# EAGLE design Nanocopter_V2.1 (EAGLE 7.2.0)

## Sheet 1 of 2
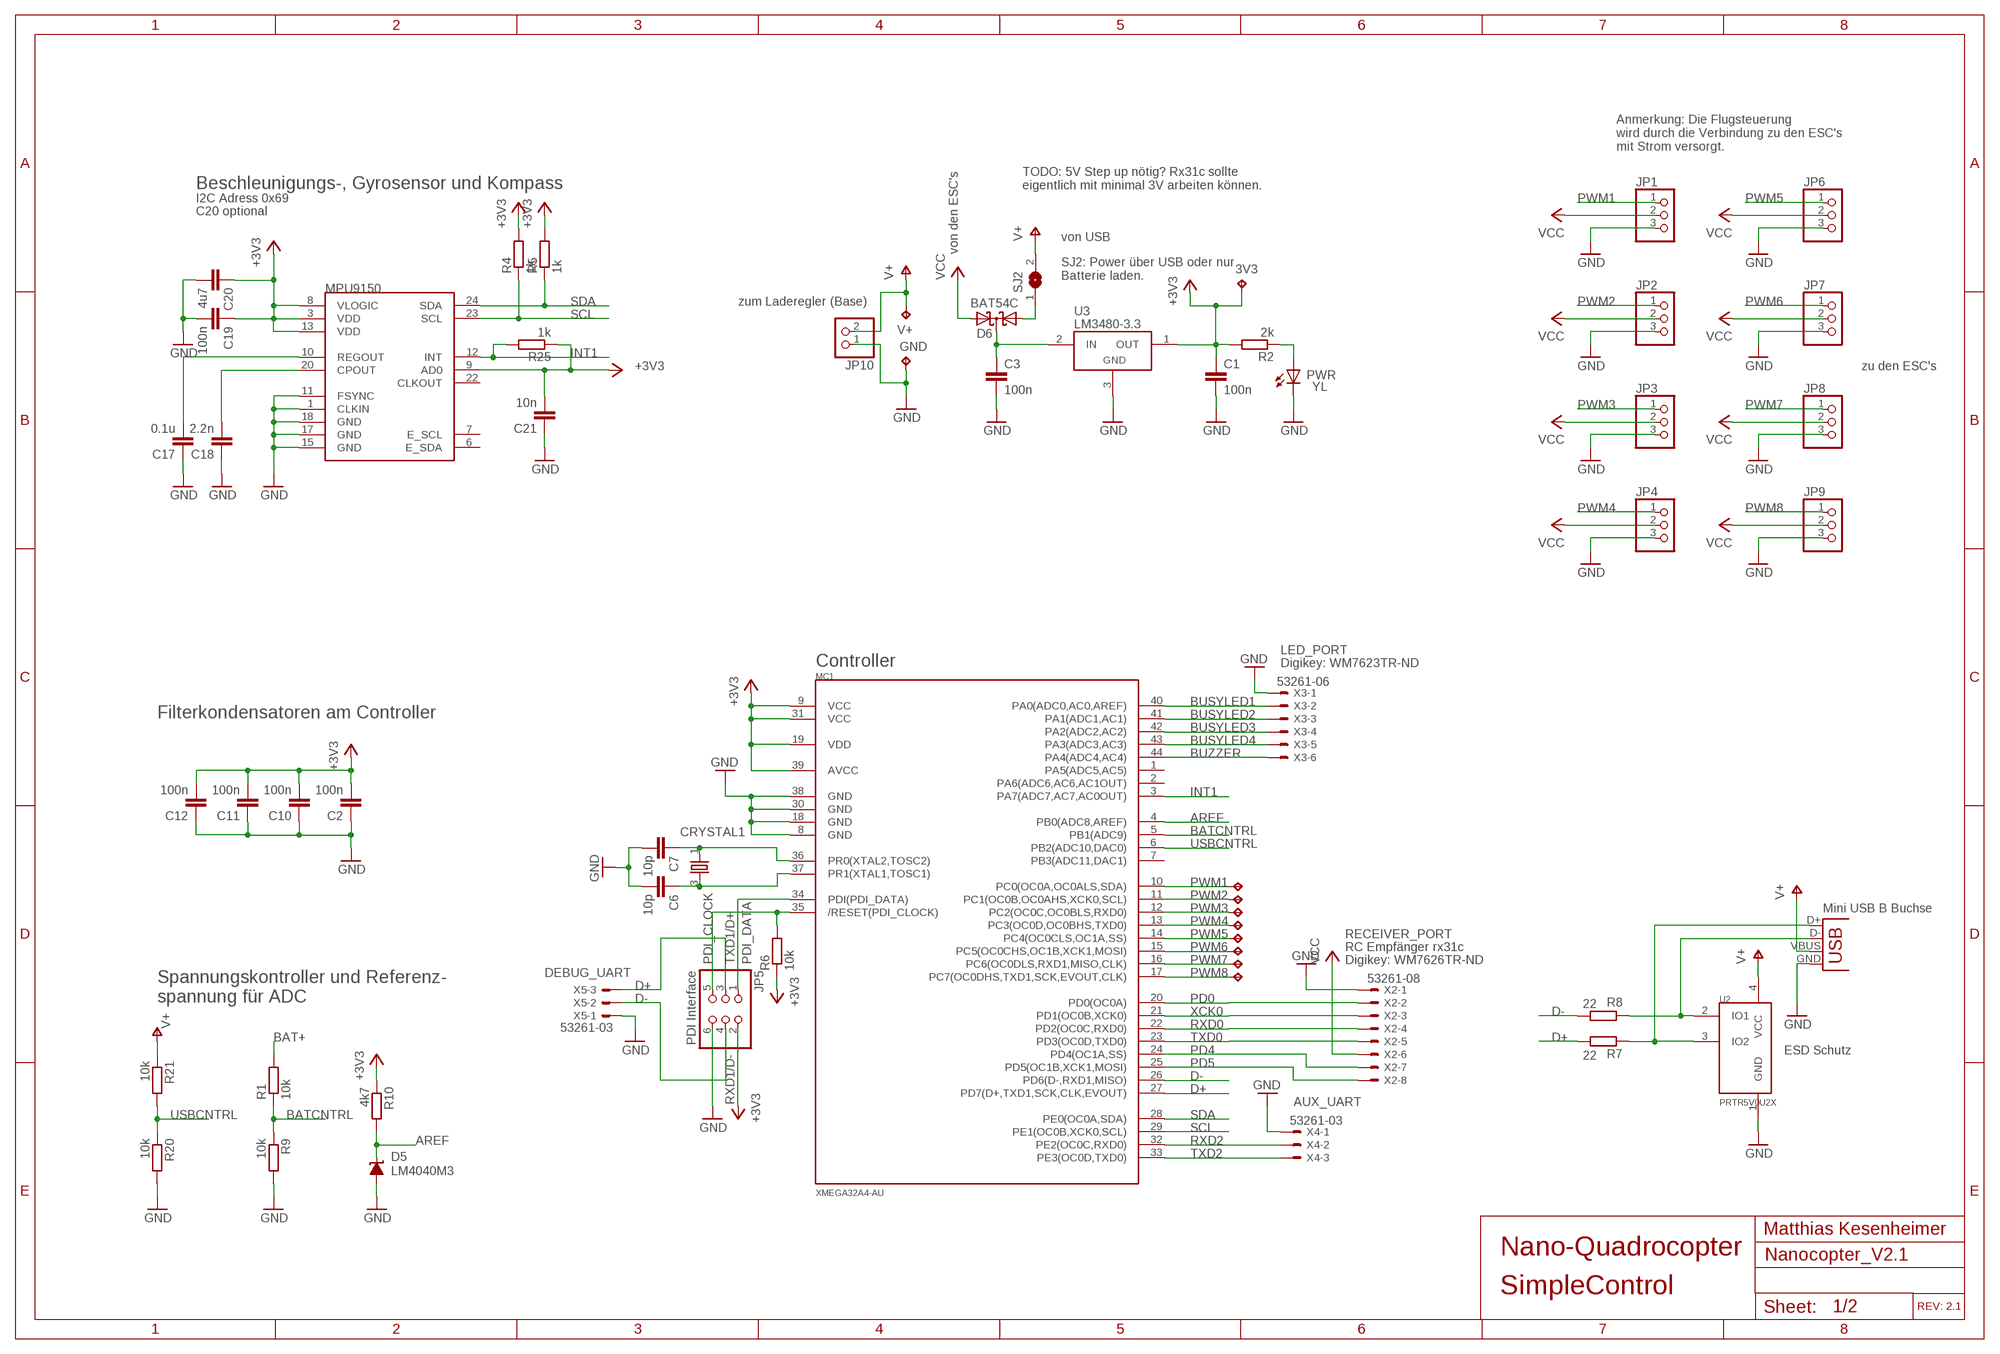
[diagram p0: schematic, sheet 1]

### Parts
3V1  TPTP12SQ  [TP12SQ]
3V2  TPTP12SQ  [TP12SQ]
3V3  TPTP12SQ  [TP12SQ]
3V4  TPTP12SQ  [TP12SQ]
3V5  TPTP12SQ  [TP12SQ]
3V6  TPTP12SQ  [TP12SQ]
3V7  TPTP12SQ  [TP12SQ]
3V8  TPTP12SQ  [TP12SQ]
C1  100n  C-EUC0603  [C0603]
C2  100n  C-EUC0603  [C0603]
C3  100n  C-EUC0603  [C0603]
C6  10p  C-EUC0603  [C0603]
C7  10p  C-EUC0603  [C0603]
C10  100n  C-EUC0603  [C0603]
C11  100n  C-EUC0603  [C0603]
C12  100n  C-EUC0603  [C0603]
C17  0.1u  C-EUC0603  [C0603]
C18  2.2n  C-EUC0603  [C0603]
C19  100n  C-EUC0603  [C0603]
C20  4u7  C-EUC0603  [C0603]
C21  10n  C-EUC0603  [C0603]
CRYSTAL1  CRYSTAL4PIN  [CRYSTAL-4PIN]
D5  LM4040M3  [SOT-23]
D6  BAT54C  [SOT23]
GND  TPTP12SQ  [TP12SQ]
JP1  PINHD-1X3  [1X03]
JP2  PINHD-1X3  [1X03]
JP3  PINHD-1X3  [1X03]
JP4  PINHD-1X3  [1X03]
JP5  PDI Interface  PINHD-2X3  [2X03]
JP6  PINHD-1X3  [1X03]
JP7  PINHD-1X3  [1X03]
JP8  PINHD-1X3  [1X03]
JP9  PINHD-1X3  [1X03]
JP10  PINHD-1X2  [1X02]
MC1  XMEGA32A4-AU  [TQFP44]
MPU9150  MPU-9150QFN-24-NP  [QFN-24-NP]
PWM1  TPTP12SQ  [TP12SQ]
PWR  YL  LEDCHIPLED_0603  [CHIPLED_0603]
R1  10k  R-EU_R0603  [R0603]
R2  2k  R-EU_R0603  [R0603]
R4  1k  R-EU_R0603  [R0603]
R5  1k  R-EU_R0603  [R0603]
R6  10k  R-EU_R0603  [R0603]
R7  22  R-EU_R0603  [R0603]
R8  22  R-EU_R0603  [R0603]
R9  10k  R-EU_R0603  [R0603]
R10  4k7  R-EU_R0603  [R0603]
R20  10k  R-EU_R0603  [R0603]
R21  10k  R-EU_R0603  [R0603]
R25  1k  R-EU_R0603  [R0603]
SJ2  SJ  [SJ]
U2  PRTR5V0U2X  [SOT143B]
U3  LM3480-3.3  [SOT-23-3]
V+  TPTP12SQ  [TP12SQ]
X1  USBSMD  [USB-MINIB]
X2  53261-08  [53261-08]
X3  53261-06  [53261-06]
X4  53261-03  [53261-03]
X5  53261-03  [53261-03]

### Nets
+3V3: 3V3.TP C1.1 C2.2 C10.2 C11.2 C12.2 C19.1 C20.1 C21.2 JP5.2 MC1.9(VCC) MC1.19(VDD) MC1.31(VCC) MC1.39(AVCC) MPU9150.3(VDD) MPU9150.8(VLOGIC) MPU9150.9(AD0) MPU9150.13(VDD) R2.2 R4.2 R5.2 R6.1 R10.1 R25.1 U3.1(OUT)
AREF: D5.1(C) MC1.4(PB0(ADC8,AREF)) R10.2
BAT+: R1.2
BATCNTRL: MC1.5(PB1(ADC9)) R1.1 R9.1
BUSYLED1: MC1.40(PA0(ADC0,AC0,AREF)) X3.2
BUSYLED2: MC1.41(PA1(ADC1,AC1)) X3.3
BUSYLED3: MC1.42(PA2(ADC2,AC2)) X3.4
BUSYLED4: MC1.43(PA3(ADC3,AC3)) X3.5
BUZZER: MC1.44(PA4(ADC4,AC4)) X3.6
D+: JP5.3 MC1.27(PD7(D+,TXD1,SCK,CLK,EVOUT)) R7.2 X5.3
D-: JP5.4 MC1.26(PD6(D-,RXD1,MISO)) R8.2 X5.2
GND: C1.2 C2.1 C3.2 C6.2 C7.2 C10.1 C11.1 C12.1 C17.1 C18.1 C19.2 C20.2 C21.1 D5.2(A) GND.TP JP1.3 JP2.3 JP3.3 JP4.3 JP5.6 JP6.3 JP7.3 JP8.3 JP9.3 JP10.1 MC1.8(GND) MC1.18(GND) MC1.30(GND) MC1.38(GND) MPU9150.1(CLKIN) MPU9150.11(FSYNC) MPU9150.15(GND) MPU9150.17(GND) MPU9150.18(GND) PWR.C R9.2 R20.2 U2.1(GND) U3.3(GND) X1.GND X2.1 X3.1 X4.1 X5.1 ; also sheet 2
INT1: MC1.3(PA7(ADC7,AC7,AC0OUT)) MPU9150.12(INT) R25.2
N$1: C18.2 MPU9150.20(CPOUT)
N$5: C17.2 MPU9150.10(REGOUT)
N$6: C3.1 D6.3(CC) U3.2(IN)
N$9: PWR.A R2.1
N$10: C7.1 CRYSTAL1.1 MC1.36(PR0(XTAL2,TOSC2))
N$15: C6.1 CRYSTAL1.3 MC1.37(PR1(XTAL1,TOSC1))
N$36: D6.1(A1) SJ2.1
PD0: MC1.20(PD0(OC0A)) X2.2
PD4: MC1.24(PD4(OC1A,SS)) X2.7
PD5: MC1.25(PD5(OC1B,XCK1,MOSI)) X2.8
PDI_CLOCK: JP5.5 MC1.35(/RESET(PDI_CLOCK)) R6.2
PDI_DATA: JP5.1 MC1.34(PDI(PDI_DATA))
PWM1: JP1.1 MC1.10(PC0(OC0A,OC0ALS,SDA)) PWM1.TP
PWM2: 3V2.TP JP2.1 MC1.11(PC1(OC0B,OC0AHS,XCK0,SCL))
PWM3: 3V4.TP JP3.1 MC1.12(PC2(OC0C,OC0BLS,RXD0))
PWM4: 3V5.TP JP4.1 MC1.13(PC3(OC0D,OC0BHS,TXD0))
PWM5: 3V1.TP JP6.1 MC1.14(PC4(OC0CLS,OC1A,SS))
PWM6: 3V6.TP JP7.1 MC1.15(PC5(OC0CHS,OC1B,XCK1,MOSI))
PWM7: 3V7.TP JP8.1 MC1.16(PC6(OC0DLS,RXD1,MISO,CLK))
PWM8: 3V8.TP JP9.1 MC1.17(PC7(OC0DHS,TXD1,SCK,EVOUT,CLK))
RXD0: MC1.22(PD2(OC0C,RXD0)) X2.4
RXD2: MC1.32(PE2(OC0C,RXD0)) X4.2
SCL: MC1.29(PE1(OC0B,XCK0,SCL)) MPU9150.23(SCL) R4.1
SDA: MC1.28(PE0(OC0A,SDA)) MPU9150.24(SDA) R5.1
TXD0: MC1.23(PD3(OC0D,TXD0)) X2.5
TXD2: MC1.33(PE3(OC0D,TXD0)) X4.3
USB+: R7.1 U2.3(IO2) X1.D+
USB-: R8.1 U2.2(IO1) X1.D-
USBCNTRL: MC1.6(PB2(ADC10,DAC0)) R20.1 R21.2
V+: JP10.2 R21.1 SJ2.2 U2.4(VCC) V+.TP X1.VBUS
VCC: D6.2(A2) JP1.2 JP2.2 JP3.2 JP4.2 JP6.2 JP7.2 JP8.2 JP9.2 X2.6 ; also sheet 2
XCK0: MC1.21(PD1(OC0B,XCK0)) X2.3
Unconnected: MC1.1(PA5(ADC5,AC5)) MC1.2(PA6(ADC6,AC6,AC1OUT)) MC1.7(PB3(ADC11,DAC1)) MPU9150.6(E_SDA) MPU9150.7(E_SCL) MPU9150.22(CLKOUT)

### Notes on the sheet
- Anmerkung: Die Flugsteuerung
  wird durch die Verbindung zu den ESC's
  mit Strom versorgt.
- Beschleunigungs-, Gyrosensor und Kompass
- TODO: 5V Step up nötig? Rx31c sollte
  eigentlich mit minimal 3V arbeiten können.
- I2C Adress 0x69
- C20 optional
- von USB
- von den ESC's
- SJ2: Power über USB oder nur
  Batterie laden.
- zum Laderegler (Base)
- zu den ESC's
- LED_PORT
- Controller | Digikey: WM7623TR-ND
- Filterkondensatoren am Controller
- TXD1/D+ | Mini USB B Buchse
- RECEIVER_PORT
- RC Empfänger rx31c
- Digikey: WM7626TR-ND
- DEBUG_UART
- Spannungskontroller und Referenz-
  spannung für ADC
- RXD1/D- | ESD Schutz
- AUX_UART
- Matthias Kesenheimer
- Nano-Quadrocopter
- SimpleControl
- REV: 2.1

## Sheet 2 of 2
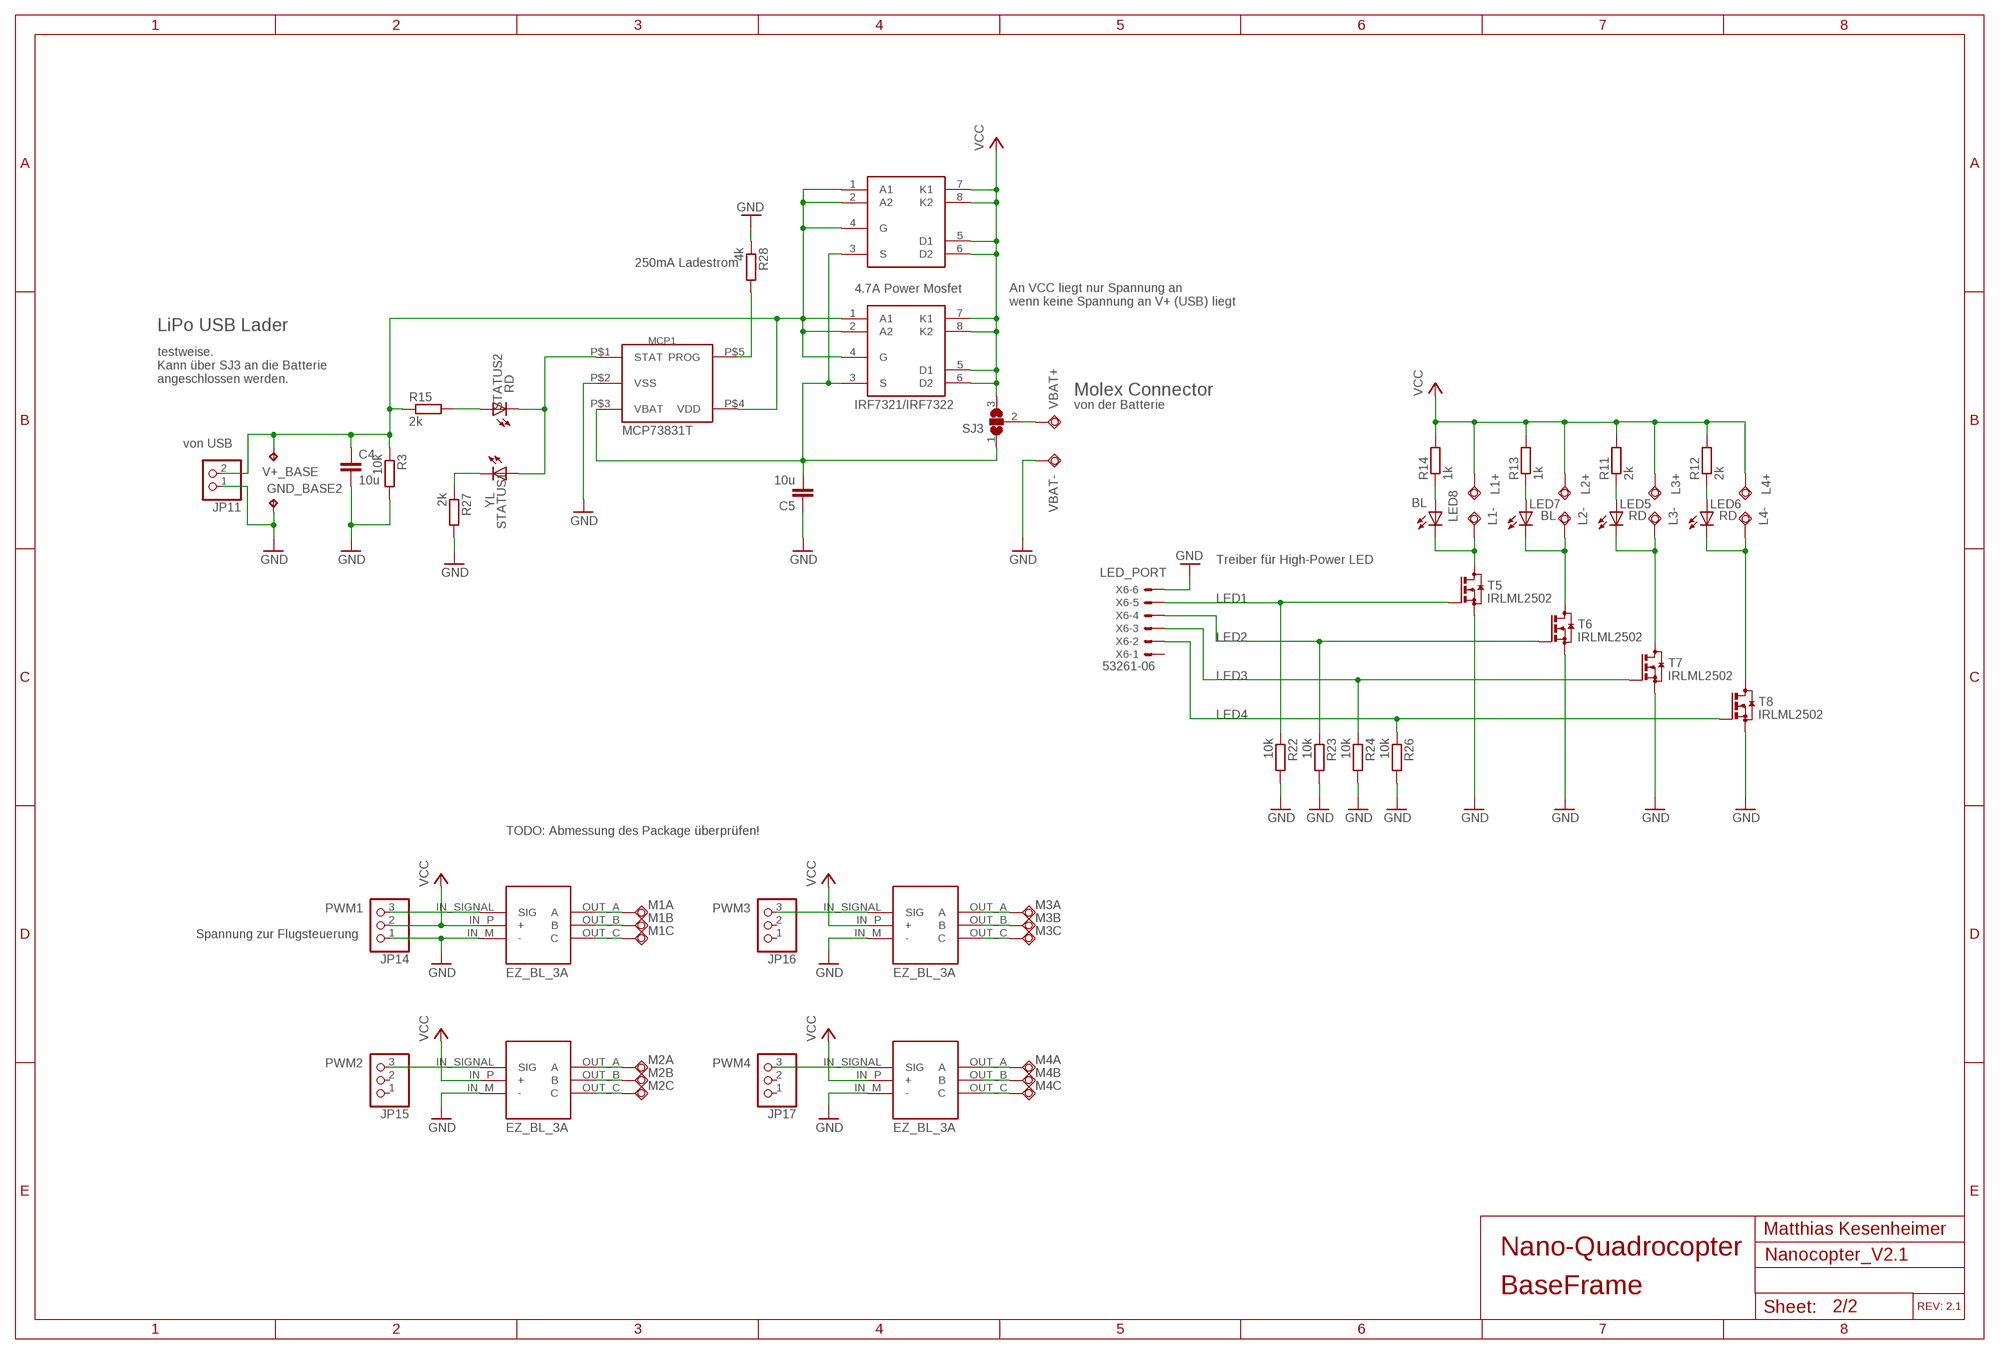
[diagram p1: schematic, sheet 2]

### Parts
C4  10u  C-EUC1206  [C1206]
C5  10u  C-EUC1206  [C1206]
GND_BASE2  TPTP12SQ  [TP12SQ]
JP11  PINHD-1X2/90  [1X02/90]
JP14  PINHD-1X3/90  [1X03/90]
JP15  PINHD-1X3/90  [1X03/90]
JP16  PINHD-1X3/90  [1X03/90]
JP17  PINHD-1X3/90  [1X03/90]
L1+  TPSQTP20SQ  [TP20SQ]
L1-  TPSQTP20SQ  [TP20SQ]
L2+  TPSQTP20SQ  [TP20SQ]
L2-  TPSQTP20SQ  [TP20SQ]
L3+  TPSQTP20SQ  [TP20SQ]
L3-  TPSQTP20SQ  [TP20SQ]
L4+  TPSQTP20SQ  [TP20SQ]
L4-  TPSQTP20SQ  [TP20SQ]
LED5  RD  LEDCHIPLED_0603  [CHIPLED_0603]
LED6  RD  LEDCHIPLED_0603  [CHIPLED_0603]
LED7  BL  LEDCHIPLED_0603  [CHIPLED_0603]
LED8  BL  LEDCHIPLED_0603  [CHIPLED_0603]
M1A  TPSQTP20SQ  [TP20SQ]
M1B  TPSQTP20SQ  [TP20SQ]
M1C  TPSQTP20SQ  [TP20SQ]
M2A  TPSQTP20SQ  [TP20SQ]
M2B  TPSQTP20SQ  [TP20SQ]
M2C  TPSQTP20SQ  [TP20SQ]
M3A  TPSQTP20SQ  [TP20SQ]
M3B  TPSQTP20SQ  [TP20SQ]
M3C  TPSQTP20SQ  [TP20SQ]
M4A  TPSQTP20SQ  [TP20SQ]
M4B  TPSQTP20SQ  [TP20SQ]
M4C  TPSQTP20SQ  [TP20SQ]
MCP1  MCP73831  [5PIN_SOT23]
R3  10k  R-EU_R0603  [R0603]
R11  2k  R-EU_R0603  [R0603]
R12  2k  R-EU_R0603  [R0603]
R13  1k  R-EU_R0603  [R0603]
R14  1k  R-EU_R0603  [R0603]
R15  2k  R-EU_R0603  [R0603]
R22  10k  R-EU_R0603  [R0603]
R23  10k  R-EU_R0603  [R0603]
R24  10k  R-EU_R0603  [R0603]
R26  10k  R-EU_R0603  [R0603]
R27  2k  R-EU_R0603  [R0603]
R28  4k  R-EU_R0603  [R0603]
SJ3  SJ2W  [SJ_2]
STATUS1  YL  LEDCHIPLED_0603  [CHIPLED_0603]
STATUS2  RD  LEDCHIPLED_0603  [CHIPLED_0603]
T5  IRLML2502  BSS123  [SOT23]
T6  IRLML2502  BSS123  [SOT23]
T7  IRLML2502  BSS123  [SOT23]
T8  IRLML2502  BSS123  [SOT23]
U$1  EAZY_BL_3A  [EZ_BL_3A_P]
U$2  EAZY_BL_3A  [EZ_BL_3A_P]
U$3  EAZY_BL_3A  [EZ_BL_3A_P]
U$4  EAZY_BL_3A  [EZ_BL_3A_P]
U$5  IRF7321  [SO8]
U$6  IRF7321  [SO8]
V+_BASE  TPTP12SQ  [TP12SQ]
VBAT+  TPSQTP20SQ  [TP20SQ]
VBAT-  TPSQTP20SQ  [TP20SQ]
X6  53261-06  [53261-06]

### Nets
GND: C4.2 C5.1 GND_BASE2.TP JP11.1 JP14.1 MCP1.P$2(VSS) R3.2 R22.2 R23.2 R24.2 R26.2 R27.2 R28.1 T5.2(S) T6.2(S) T7.2(S) T8.2(S) U$1.IN_M(-) U$2.IN_M(-) U$3.IN_M(-) U$4.IN_M(-) VBAT-.TP X6.6 ; also sheet 1
LED1: R22.1 T5.1(G) X6.5
LED2: R23.1 T6.1(G) X6.4
LED3: R24.1 T7.1(G) X6.3
LED4: R26.1 T8.1(G) X6.2
N$2: LED5.A R11.1
N$3: LED6.A R12.1
N$4: LED7.A R13.1
N$11: L1-.TP LED8.C T5.3(D)
N$12: L3-.TP LED5.C T7.3(D)
N$13: L4-.TP LED6.C T8.3(D)
N$14: L2-.TP LED7.C T6.3(D)
N$16: MCP1.P$5(PROG) R28.2
N$17: JP14.3 U$1.IN_SIGNAL(SIG)
N$18: M2A.TP U$2.OUT_A(A)
N$19: LED8.A R14.1
N$20: C5.2 MCP1.P$3(VBAT) SJ3.1 U$5.3(S) U$6.3(S)
N$21: M2B.TP U$2.OUT_B(B)
N$22: M2C.TP U$2.OUT_C(C)
N$23: R15.2 STATUS2.A
N$24: M1A.TP U$1.OUT_A(A)
N$25: M1B.TP U$1.OUT_B(B)
N$26: M1C.TP U$1.OUT_C(C)
N$27: JP15.3 U$2.IN_SIGNAL(SIG)
N$28: M3A.TP U$3.OUT_A(A)
N$29: M3B.TP U$3.OUT_B(B)
N$30: M3C.TP U$3.OUT_C(C)
N$31: JP16.3 U$3.IN_SIGNAL(SIG)
N$32: M4A.TP U$4.OUT_A(A)
N$33: M4B.TP U$4.OUT_B(B)
N$34: M4C.TP U$4.OUT_C(C)
N$35: JP17.3 U$4.IN_SIGNAL(SIG)
N$37: R27.1 STATUS1.C
N$38: MCP1.P$1(STAT) STATUS1.A STATUS2.C
N$39: SJ3.2 VBAT+.TP
VCC: JP14.2 L1+.TP L2+.TP L3+.TP L4+.TP R11.2 R12.2 R13.2 R14.2 SJ3.3 U$1.IN_P(+) U$2.IN_P(+) U$3.IN_P(+) U$4.IN_P(+) U$5.5(D1) U$5.6(D2) U$5.7(K1) U$5.8(K2) U$6.5(D1) U$6.6(D2) U$6.7(K1) U$6.8(K2) ; also sheet 1
VDD: C4.1 JP11.2 MCP1.P$4(VDD) R3.1 R15.1 U$5.1(A1) U$5.2(A2) U$5.4(G) U$6.1(A1) U$6.2(A2) U$6.4(G) V+_BASE.TP
Unconnected: JP15.1 JP15.2 JP16.1 JP16.2 JP17.1 JP17.2 X6.1

### Notes on the sheet
- 250mA Ladestrom
- 4.7A Power Mosfet
- An VCC liegt nur Spannung an
  wenn keine Spannung an V+ (USB) liegt
- LiPo USB Lader
- testweise.
  Kann über SJ3 an die Batterie
  angeschlossen werden.
- Molex Connector
- IRF7321/IRF7322 | von der Batterie
- MCP73831T
- von USB
- Treiber für High-Power LED
- LED_PORT
- TODO: Abmessung des Package überprüfen!
- PWM1 | PWM3
- Spannung zur Flugsteuerung
- EZ_BL_3A | EZ_BL_3A
- PWM2 | PWM4
- EZ_BL_3A | EZ_BL_3A
- Matthias Kesenheimer
- Nano-Quadrocopter
- BaseFrame
- REV: 2.1

## Library data of the parts
3V1-3V8 GND GND_BASE2 PWM1 V+ V+_BASE = testpad:TP: Test pad
C1-C7 C10-C12 C17-C21 = rcl:C-EU: CAPACITOR, European symbol
CRYSTAL1 = BaseApp:CRYSTAL: CRYSTAL SMD-10.5X4.8-2PIN :- http://www.digikey.com/product-detail/en/CX49GFNB12000H0PESZZ/478-4349-1-ND/1532102 SMD-5X3- 4PIN :- 535-11281-1-ND
D5 = texas:LM4040M3
D6 = diode:BAT54C: Schottky Diodes Source: Fairchild .. BAT54.pdf
JP1-JP4 JP6-JP9 JP14-JP17 = pinhead:PINHD-1X3: PIN HEADER
JP5 = pinhead:PINHD-2X3: PIN HEADER
JP10 JP11 = pinhead:PINHD-1X2: PIN HEADER
L1+ L1- L2+ L2- L3+ L3- L4+ L4- M1A M1B M1C M2A M2B M2C M3A M3B M3C M4A M4B M4C VBAT+ VBAT- = testpad:TPSQ: Test pad
LED5-LED8 PWR STATUS1 STATUS2 = led:LED: LED OSRAM: - CHIPLED LG R971, LG N971, LY N971, LG Q971, LY Q971, LO R971, LY R971 LH N974, LH R974 LS Q976, LO Q976, LY Q976 LO Q996 - Hyper CHIPLED LW Q18S LB Q993, LB Q99A, LB R99A - SideLED LS A670, LO A670, LY A670, LG A670, LP A670 LB A673, LV A673, LT A673, LW A673 LH A674 LY A675 LS A676, LA A676, LO A676, LY A676, LW A676 LS A679, LY A679, LG A679 - Hyper Micro SIDELED® LS Y876, LA Y876, LO Y876, LY Y876 LT Y87S - SmartLED LW L88C, LW L88S LB L89C, LB L89S, LG L890 LS L89K, LO L89K, LY L89K LS L896, LA L896, LO L896, LY L896 - TOPLED LS T670, LO T670, LY T670, LG T670, LP T670 LSG T670, LSP T670, LSY T670, LOP T670, LYG T670 LG T671, LOG T671, LSG T671 LB T673, LV T673, LT T673, LW T673 LH T674 LS T676, LA T676, LO T676, LY T676, LB T676, LH T676, LSB T676, LW T676 LB T67C, LV T67C, LT T67C, LS T67K, LO T67K, LY T67K, LW E67C LS E67B, LA E67B, LO E67B, LY E67B, LB E67C, LV E67C, LT E67C LW T67C LS T679, LY T679, LG T679 LS T770, LO T770, LY T770, LG T770, LP T770 LB T773, LV T773, LT T773, LW T773 LH T774 LS E675, LA E675, LY E675, LS T675 LS T776, LA T776, LO T776, LY T776, LB T776 LHGB T686 LT T68C, LB T68C - Hyper Mini TOPLED® LB M676 - Mini TOPLED Santana® LG M470 LS M47K, LO M47K, LY M47K Source: http://www.osram.convergy.de LUXEON: - LUMILED® LXK2-PW12-R00, LXK2-PW12-S00, LXK2-PW14-U00, LXK2-PW14-V00 LXK2-PM12-R00, LXK2-PM12-S00, LXK2-PM14-U00 LXK2-PE12-Q00, LXK2-PE12-R00, LXK2-PE12-S00, LXK2-PE14-T00, LXK2-PE14-U00 LXK2-PB12-K00, LXK2-PB12-L00, LXK2-PB12-M00, LXK2-PB14-N00, LXK2-PB14-P00, LXK2-PB14-Q00 LXK2-PR12-L00, LXK2-PR12-M00, LXK2-PR14-Q00, LXK2-PR14-R00 LXK2-PD12-Q00, LXK2-PD12-R00, LXK2-PD12-S00 LXK2-PH12-R00, LXK2-PH12-S00 LXK2-PL12-P00, LXK2-PL12-Q00, LXK2-PL12-R00 Source: www.luxeon.com KINGBRIGHT: KA-3528ASYC Source: www.kingbright.com
MC1 = atmel:XMEGA32A4-AU
MCP1 = BaseApp:MCP73831: Digikey No:- __MCP73831T-2ACI/OTCT-ND__
MPU9150 = SparkFun-Sensors:MPU-9150: 9DOF (3mag, 3accel, 3rotat). I2C interface.
R1-R15 R20-R28 = rcl:R-EU_: RESISTOR, European symbol
SJ2 = jumper:SJ: SMD solder JUMPER
SJ3 = jumper:SJ2W: SMD solder JUMPER
T5-T8 = transistor-small-signal:BSS123: N-CHANNEL MOS FET
U2 = Philips:PRTR5V0U2X
U3 = regulators:LM3480-*: National Semiconductor LM3480 100 mA, SOT-23, quasi-LDO linear regulator
U$1-U$4 = eazy_bl_3A:EAZY_BL_3A
U$5 U$6 = irf:IRF7321
X1 = SparkFun:USB: USB Connectors USB-B-PTH is fully proven SKU : PRT-00139 USB-miniB is fully proven SKU : PRT-00587 USB-A-PCB is untested. USB-A-H is throughly reviewed, but untested. Spark Fun Electronics SKU : PRT-00437 USB-B-SMT is throughly reviewed, but untested. Needs silkscreen touching up. USB-A-S has not been used/tested USB-MB-H has not been used/tested
X2 = con-molex:53?-08: CONNECTOR wire to board 1.25 mm (.049 inch) pitch header; OC_FARNELL: 1125376; OC_NEWARK: unknown
X3 X6 = con-molex:53?-06: CONNECTOR wire to board 1.25 mm (.049 inch) pitch header; OC_FARNELL: 1125375; OC_NEWARK: unknown
X4 X5 = con-molex:53?-03: CONNECTOR wire to board 1.25 mm (.049 inch) pitch header; MF: MOLEX; MPN: 53261-0390; OC_FARNELL: 1125359; OC_NEWARK: 57H5006

## Board
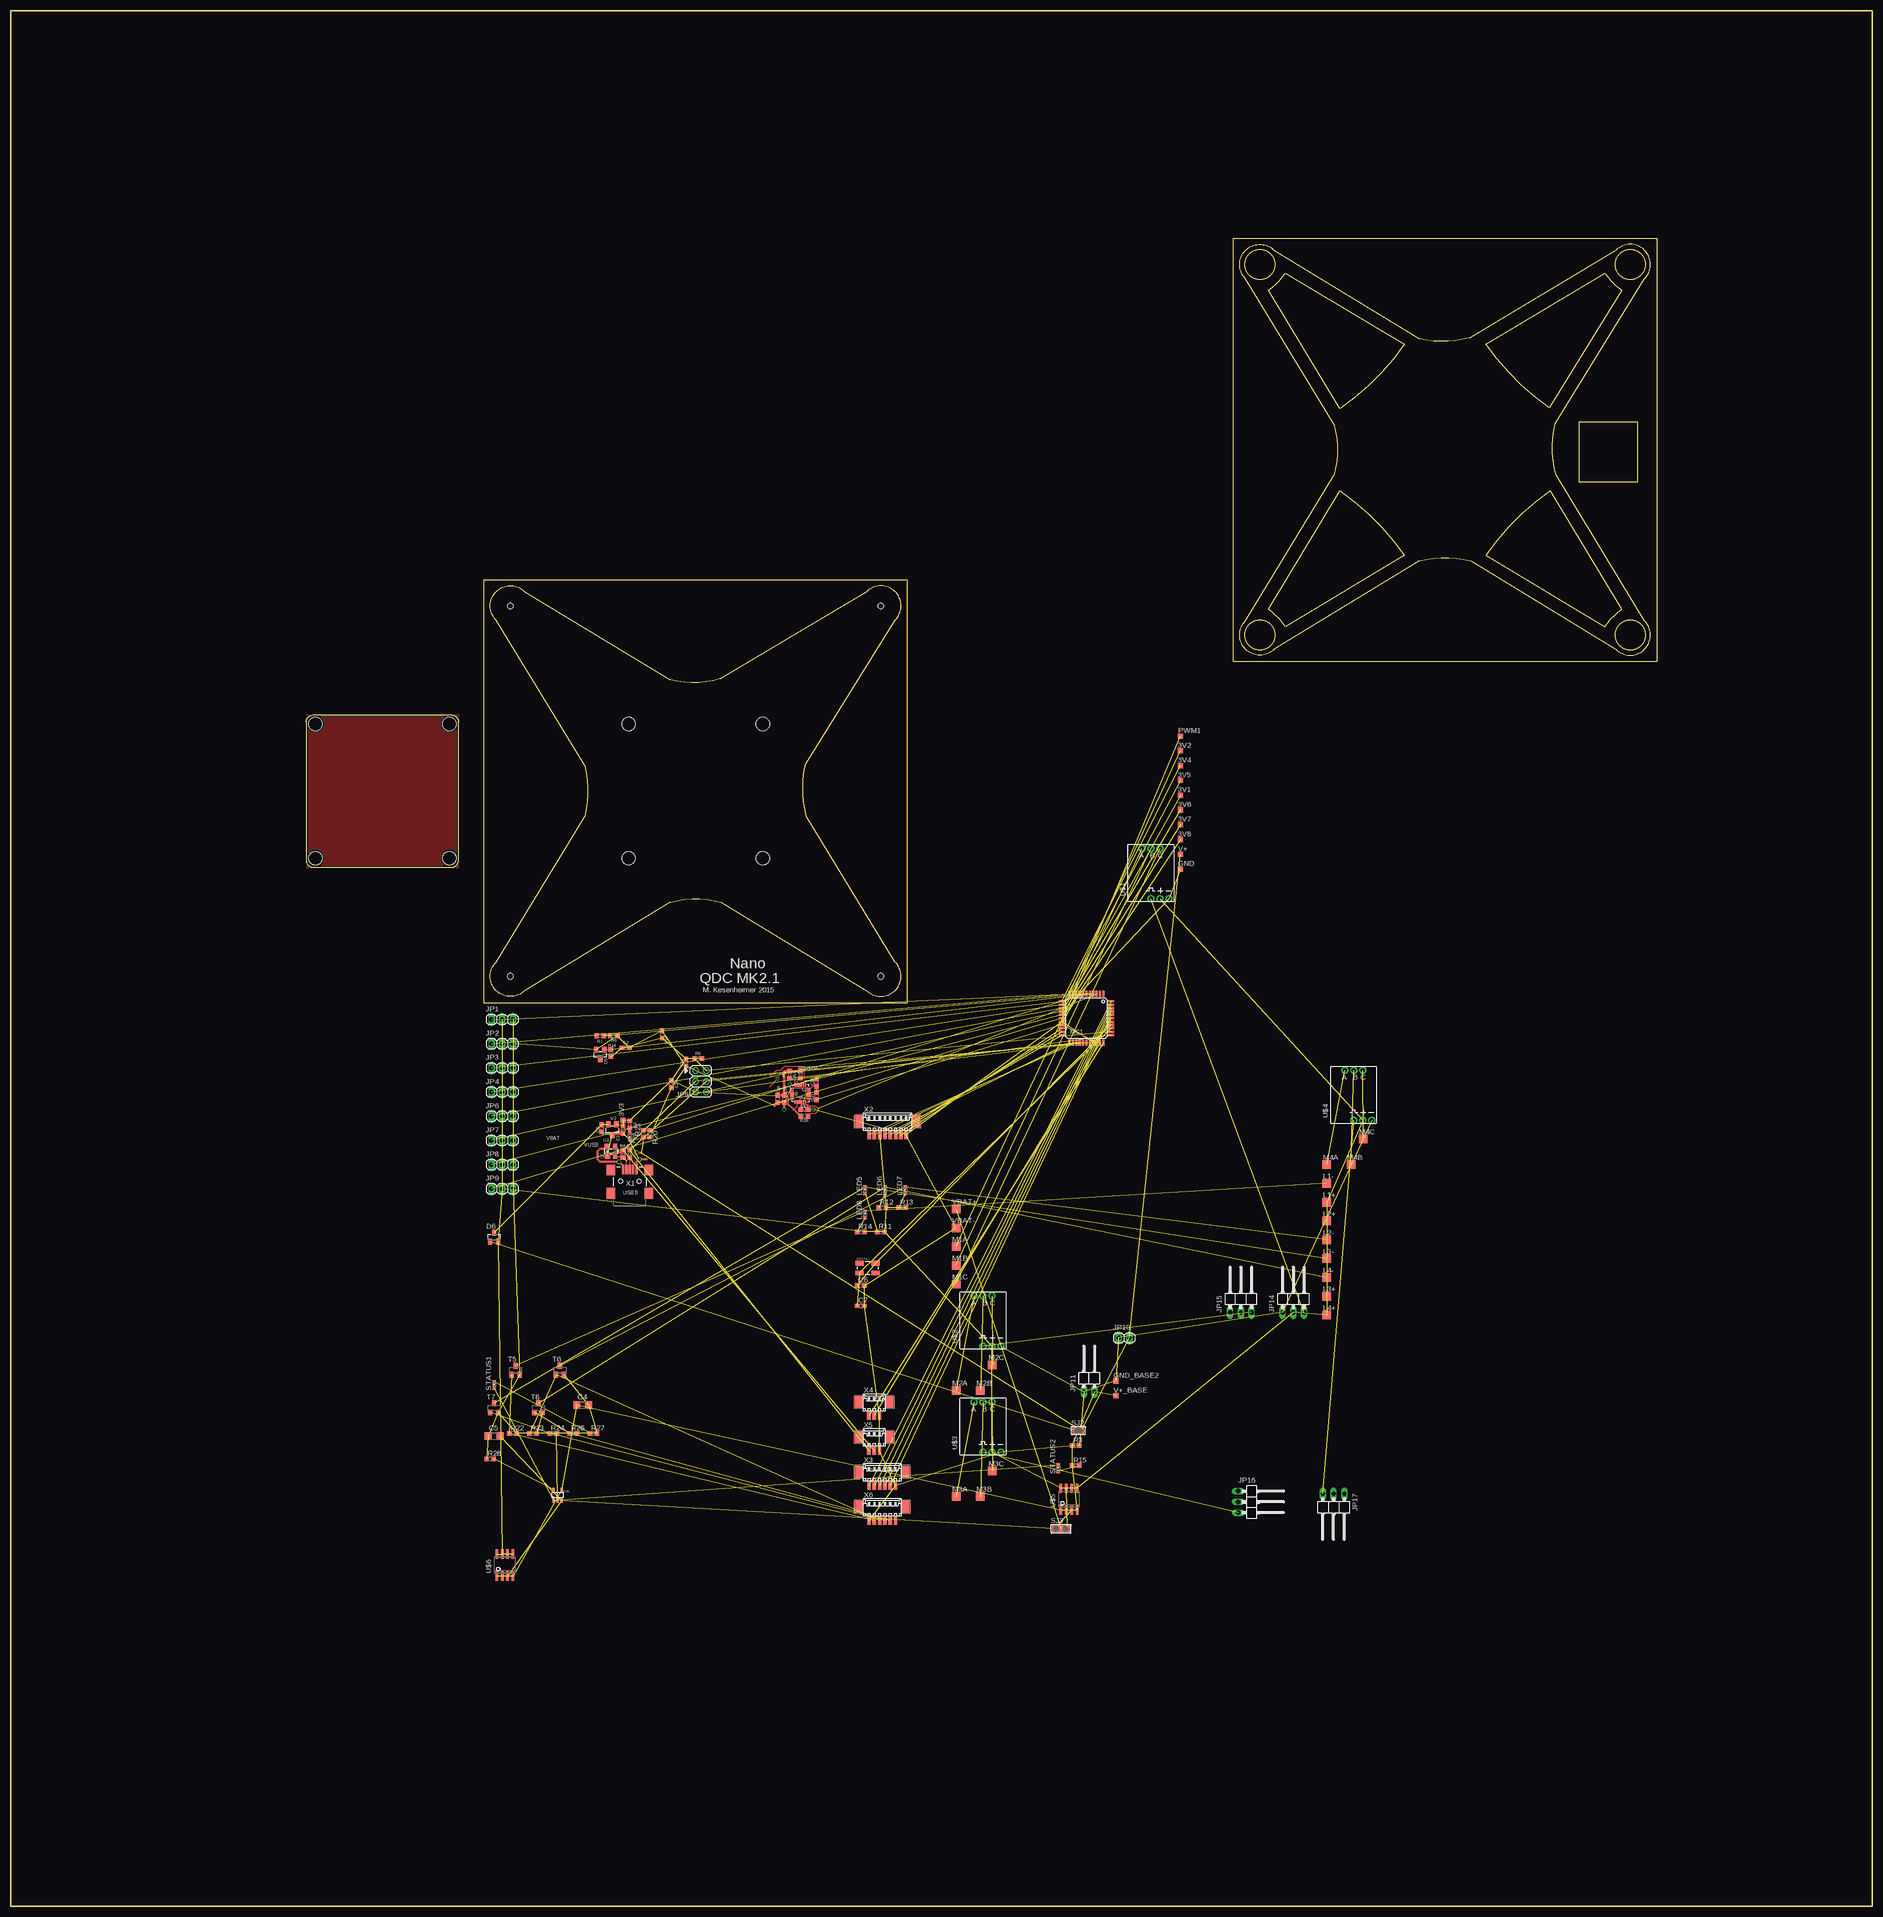
[diagram p2: board, top side]
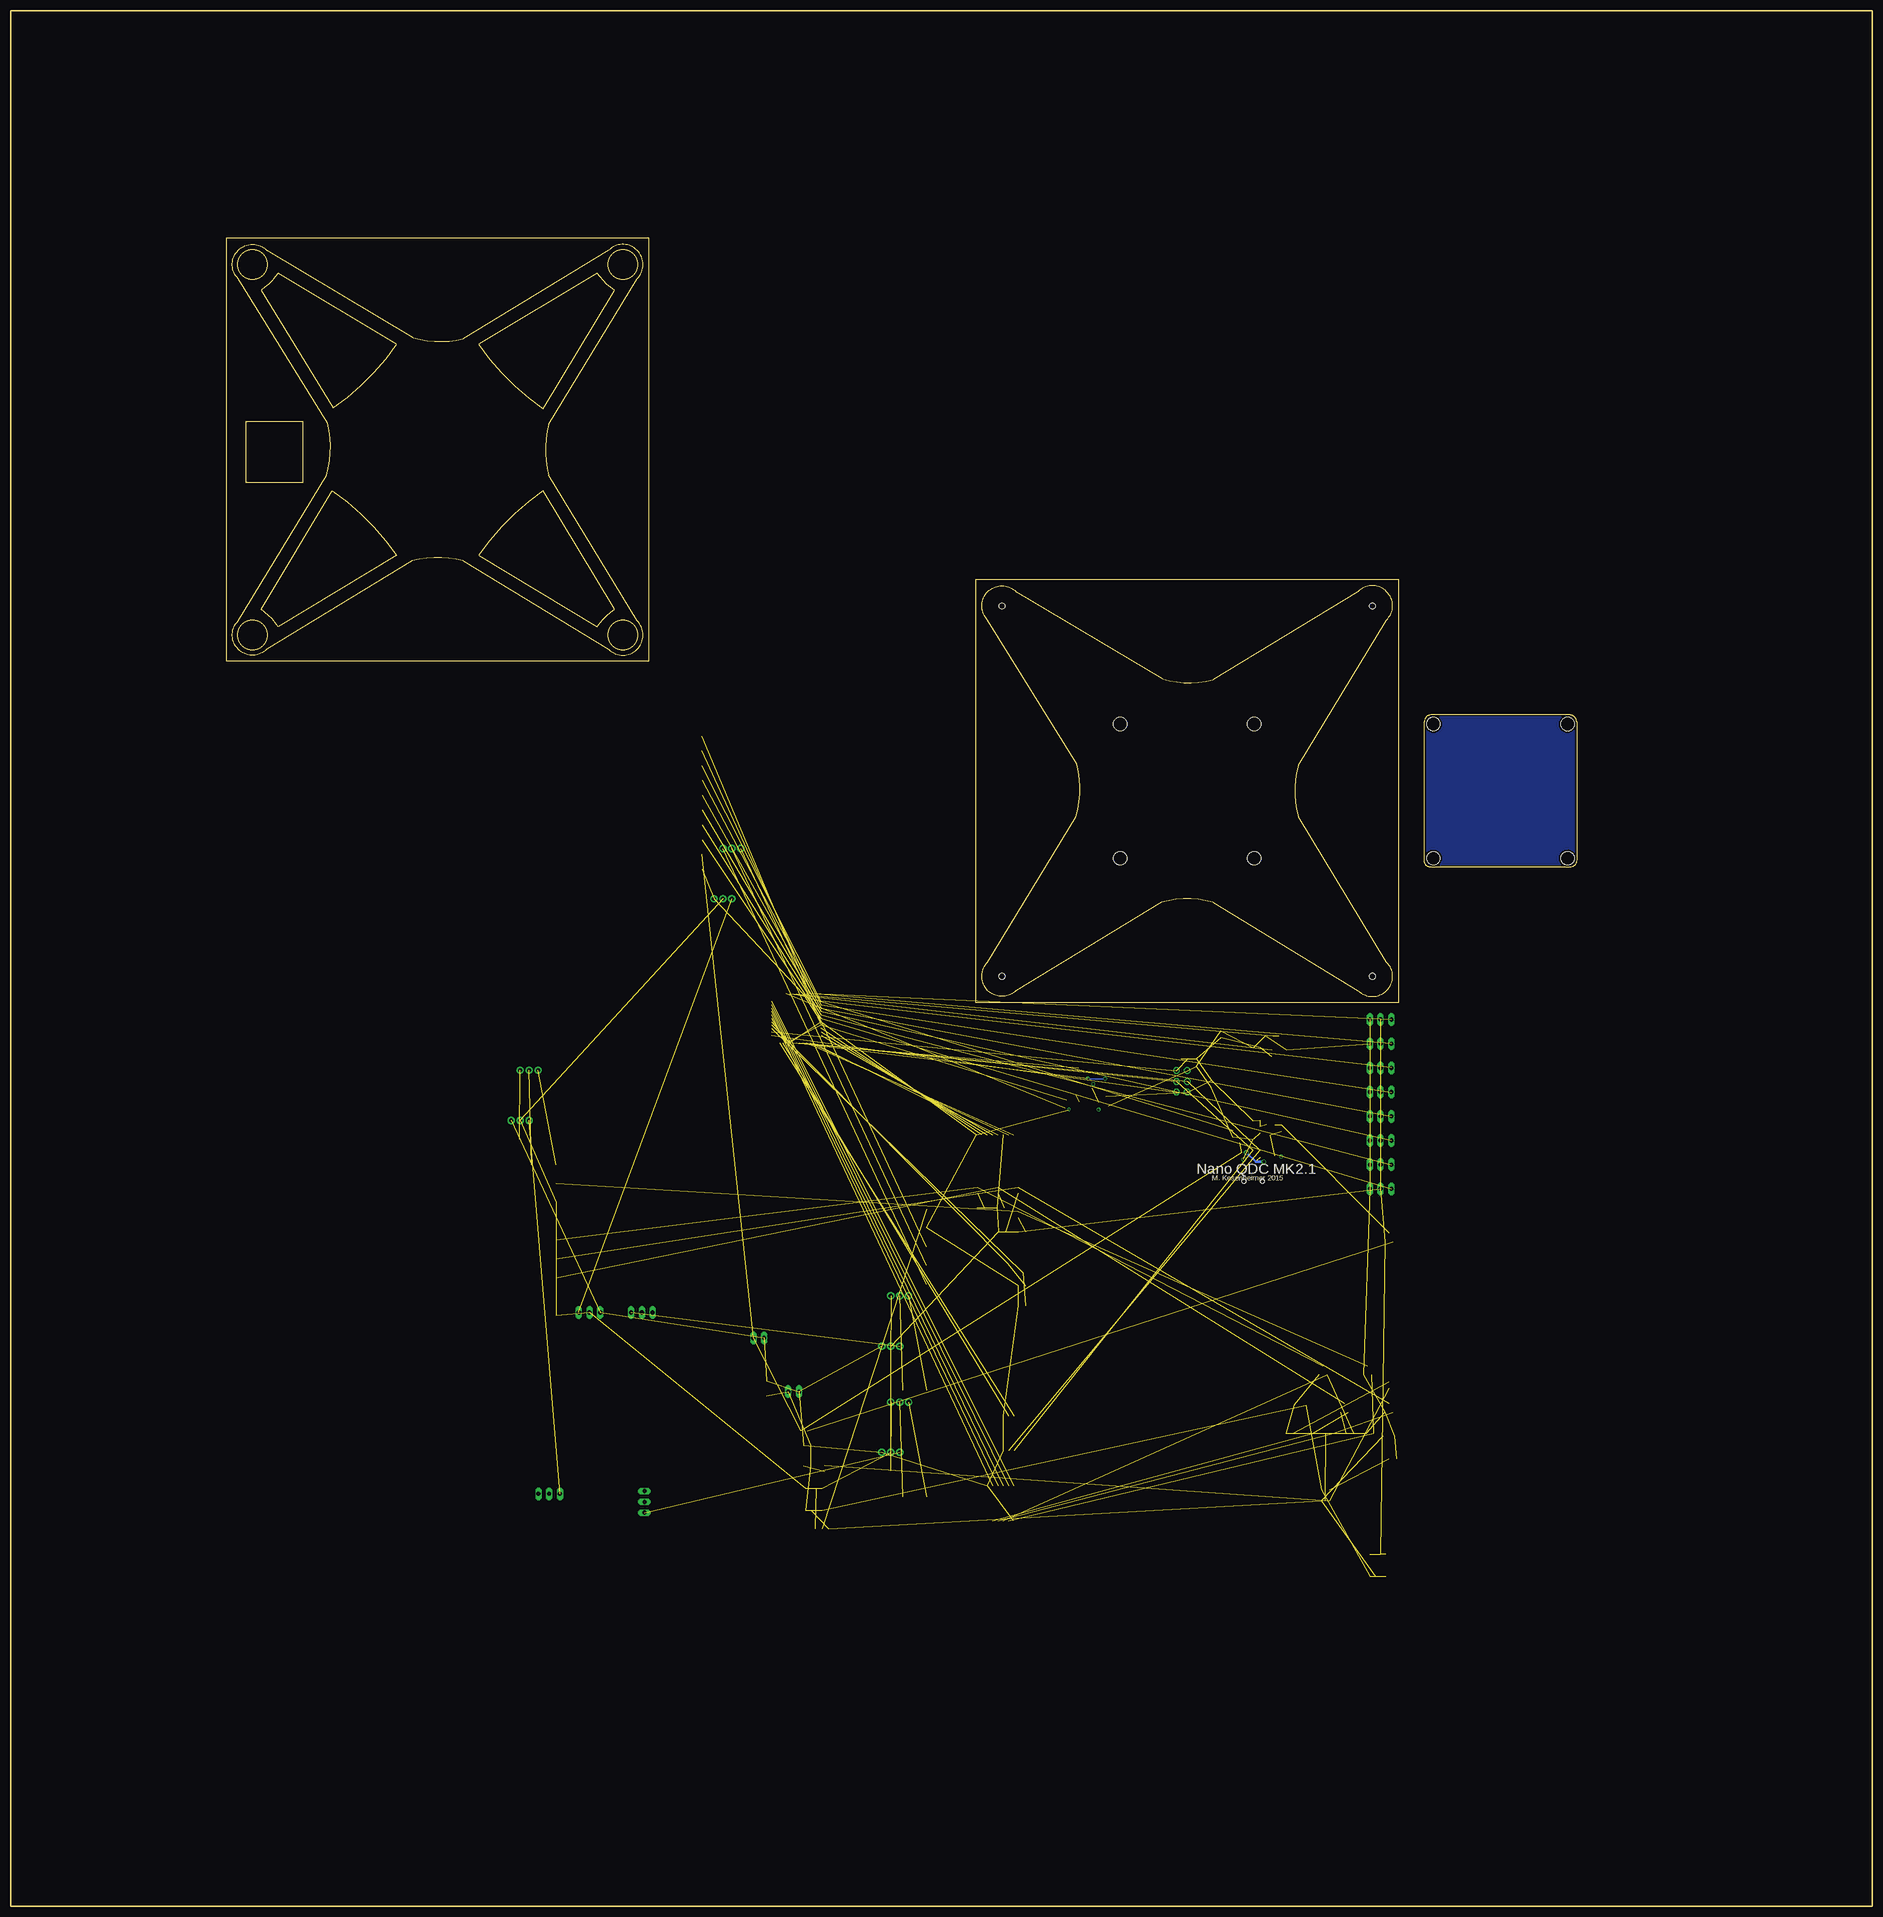
[diagram p3: board, bottom side, seen from below]

Size 440.06 x 447.99 mm. Coordinates in mm from the lower left corner, seen from the top.
Outline: 155.87,237.28 arc-30 167.99,237.28 202.34,216.4 arc90 209.08,216.4 arc90 209.08,223.14 188.2,257.49 arc-30 187.97,269.84 209.08,303.96 arc90 209.08,310.7 arc90 202.34,310.7 167.77,290.04 arc-30 155.87,289.82 121.52,310.7 arc90 114.78,310.7 arc90 114.78,303.96 135.66,269.61 arc-30 135.66,257.49 114.78,223.14 arc90 114.78,216.4 arc90 121.52,216.4 155.87,237.28
Outline: 111.93,213.52 111.93,313.52 211.93,313.52 211.93,213.52 111.93,213.52
Outline: 69.88,279.88 69.88,247.17 arc90 71.53,245.52 104.24,245.52 arc90 105.89,247.17 105.89,279.88 arc90 104.22,281.53 71.53,281.53 arc90 69.88,279.88
Outline: 333.03,317.93 arc-30 345.16,317.93 379.5,297.05 arc90 386.24,297.05 arc90 386.24,303.78 365.36,338.13 arc-30 365.14,350.48 386.24,384.61 arc90 386.24,391.34 arc90 379.5,391.34 344.93,370.69 arc-30 333.03,370.46 298.68,391.34 arc90 291.95,391.34 arc90 291.95,384.61 312.83,350.26 arc-30 312.83,338.13 291.95,303.78 arc90 291.95,297.05 arc90 298.68,297.05 333.03,317.93
Outline: 376.81,302.44 arc-20 380.85,306.48 364.01,334.54 arc20 348.75,319.28 376.81,302.44
Outline: 363.79,354.07 arc-20 348.75,369.12 376.81,385.95 arc20 380.85,381.91 363.79,354.07
Outline: 329.44,369.12 arc-20 314.17,353.85 297.34,381.91 arc20 301.38,385.95 329.44,369.12
Outline: 314.17,334.54 arc-20 329.44,319.28 301.38,302.44 arc20 297.34,306.48 314.17,334.54
Outline: 289.09,294.17 289.09,394.17 389.09,394.17 389.09,294.17 289.09,294.17
Outline: 384.49,336.55 370.84,336.55 370.84,350.84 384.49,350.84 384.49,336.55
Outline: 0,447.99 440.06,447.99 440.06,0 0,0 0,447.99
Outline: circle at 382.87,387.98 radius 3.55
Outline: circle at 382.87,300.42 radius 3.55
Outline: circle at 295.32,387.98 radius 3.55
Outline: circle at 295.32,300.42 radius 3.55
Copper layers (1*16): Top 0.035mm / dielectric 1.5mm / Bottom 0.035mm
Design rules "default": minimum track width 6mil, minimum drill 12mil, track to track 6mil, track to pad 6mil, pad to pad 6mil, via to via 6mil, smd to smd 0mil, copper to edge 10mil, drill to drill 10mil, minimum pad ring 10mil, minimum via ring 6mil, stop-mask expansion 2mil, vias tented up to drill 100mil, thermal gap 10mil
Holes 3.2 mm at 72.03,279.37 72.03,247.68 103.73,247.68 103.73,279.37 146.08,279.37 146.08,247.68 177.77,247.68 177.77,279.37
Holes 1.4 mm at 118.16,307.29 205.69,307.29 205.69,219.76 118.16,219.76

### Footprints (pad centres in the part's own frame; a part is rotated, then mirrored left to right if it is on the bottom)
TP12SQ = smd 1.2 x 1.2: TP 0,0
C0603 = smd 1.1 x 1: 1 -0.85,0; 2 0.85,0
C1206 = smd 1.6 x 1.8: 1 -1.4,0; 2 1.4,0
CRYSTAL-4PIN = smd 1.9 x 1.1: 1 -1.85,-1.15; 2 1.85,-1.15; 3 1.85,1.15; 4 -1.85,1.15
SOT-23 = smd 1 x 1.4: 1 -0.95,-1.1; 2 0.95,-1.1; 3 0,1.1
SOT23 = smd 1 x 1.4: 1 -0.95,-1.1; 2 0.95,-1.1; 3 0,1.1
1X03 = drill 1.016 long: 1 -2.54,0; 2 0,0; 3 2.54,0
2X03 = drill 1.016 octagon: 1 -2.54,-1.27; 2 -2.54,1.27; 3 0,-1.27; 4 0,1.27; 5 2.54,-1.27; 6 2.54,1.27
1X02 = drill 1.016 long: 1 -1.27,0; 2 1.27,0
1X02/90 = drill 1.016 long: 1 -1.27,-3.81; 2 1.27,-3.81
1X03/90 = drill 1.016 long: 1 -2.54,-3.81; 2 0,-3.81; 3 2.54,-3.81
TP20SQ = smd 2 x 2: TP 0,0
CHIPLED_0603 = smd 0.8 x 0.8: A 0,-0.75; C 0,0.75
TQFP44 = smd 1.5 x 0.5: 1 -5.8,4; 2 -5.8,3.2; 3 -5.8,2.4; 4 -5.8,1.6; 5 -5.8,0.8; 6 -5.8,0; 7 -5.8,-0.8; 8 -5.8,-1.6; 9 -5.8,-2.4; 10 -5.8,-3.2; 11 -5.8,-4; 23 5.8,-4; 24 5.8,-3.2; 25 5.8,-2.4; 26 5.8,-1.6; 27 5.8,-0.8; 28 5.8,0; 29 5.8,0.8; 30 5.8,1.6; 31 5.8,2.4; 32 5.8,3.2; 33 5.8,4 | smd 0.5 x 1.5: 12 -4,-5.8; 13 -3.2,-5.8; 14 -2.4,-5.8; 15 -1.6,-5.8; 16 -0.8,-5.8; 17 0,-5.8; 18 0.8,-5.8; 19 1.6,-5.8; 20 2.4,-5.8; 21 3.2,-5.8; 22 4,-5.8; 34 4,5.8; 35 3.2,5.8; 36 2.4,5.8; 37 1.6,5.8; 38 0.8,5.8; 39 0,5.8; 40 -0.8,5.8; 41 -1.6,5.8; 42 -2.4,5.8; 43 -3.2,5.8; 44 -4,5.8
5PIN_SOT23 = smd 0.4 x 1: P$1 0.4,-0.63; P$2 1.35,-0.63; P$3 2.3,-0.63; P$4 2.3,1.87; P$5 0.4,1.87
QFN-24-NP = smd 0.8 x 0.3: 1 -2,1.25; 2 -2,0.75; 3 -2,0.25; 4 -2,-0.25; 5 -2,-0.75; 6 -2,-1.25; 13 2,-1.25; 14 2,-0.75; 15 2,-0.25; 16 2,0.25; 17 2,0.75; 18 2,1.25 | smd 0.3 x 0.8: 7 -1.25,-2; 8 -0.75,-2; 9 -0.25,-2; 10 0.25,-2; 11 0.75,-2; 12 1.25,-2; 19 1.25,2; 20 0.75,2; 21 0.25,2; 22 -0.25,2; 23 -0.75,2; 24 -1.25,2
R0603 = smd 1 x 1.1: 1 -0.85,0; 2 0.85,0
SJ = smd 1.168 x 1.6: 1 -0.762,0; 2 0.762,0
SJ_2 = smd 1.168 x 1.6: 1 -1.524,0; 2 0,0; 3 1.524,0
SOT143B = smd 1.2 x 1.44: 1 -0.75,-1.1 | smd 1 x 1.44: 2 0.95,-1.1; 3 0.95,1.1; 4 -0.95,1.1
SOT-23-3 = smd 1.016 x 1.397: 1 -0.953,-1.27; 2 0.953,-1.27; 3 0,1.27
EZ_BL_3A_P = drill 1 pad 1.676: IN_M 9.64,0.6; IN_P 7.52,0.6; IN_SIGNAL 5.4,0.6; OUT_A 3.28,12.48; OUT_B 5.4,12.48; OUT_C 7.52,12.48
SO8 = smd 0.6 x 2.2: 1 -1.905,-2.6; 2 -0.635,-2.6; 3 0.635,-2.6; 4 1.905,-2.6; 5 1.905,2.6; 6 0.635,2.6; 7 -0.635,2.6; 8 -1.905,2.6
USB-MINIB = smd 2.25 x 0.5: D+ 2.625,0; D- 2.625,0.8; GND 2.625,-1.6; ID 2.625,-0.8; VBUS 2.625,1.6 | smd 2.5 x 2: MTN1 -2.95,4.45; MTN2 2.5,4.45; MTN3 -2.95,-4.45; MTN4 2.5,-4.45 | hole 1: -0.07,2.2; -0.07,-2.2
53261-08 = smd 0.8 x 2: 1 4.375,-2.5; 2 3.125,-2.5; 3 1.875,-2.5; 4 0.625,-2.5; 5 -0.625,-2.5; 6 -1.875,-2.5; 7 -3.125,-2.5; 8 -4.375,-2.5 | smd 2.1 x 3: S1 6.875,0.625; S2 -6.875,0.625
53261-06 = smd 0.8 x 2: 1 3.125,-2.5; 2 1.875,-2.5; 3 0.625,-2.5; 4 -0.625,-2.5; 5 -1.875,-2.5; 6 -3.125,-2.5 | smd 2.1 x 3: S1 5.625,0.625; S2 -5.625,0.625
53261-03 = smd 0.8 x 2: 1 1.25,-2.5; 2 0,-2.5; 3 -1.25,-2.5 | smd 2.1 x 3: S1 3.75,0.625; S2 -3.75,0.625

### Placement (x,y rotation side)
3V1  276.54,262.57 0 top
3V2  276.54,273.05 0 top
3V3  144.78,185.74 0 top
3V4  276.54,269.56 0 top
3V5  276.54,266.06 0 top
3V6  276.54,259.08 0 top
3V7  276.54,255.59 0 top
3V8  276.54,252.09 0 top
C1  144.78,183.51 270 top
C2  145.42,202.88 180 top
C3  139.7,183.83 270 top
C4  135.25,118.43 0 top
C5  114.3,111.12 0 top
C6  200.98,146.68 0 top
C7  200.98,141.92 0 top
C10  153.99,206.06 270 top
C11  159.7,199.39 90 top
C12  156.21,194.31 90 top
C17  187.64,188.28 180 top
C18  190.5,194.63 90 top
C19  182.88,190.82 270 top
C20  181.29,190.82 270 top
C21  190.5,191.45 270 top
CRYSTAL1  202.56,150.81 0 top
D5  139.38,201.29 180 top
D6  114.3,158.11 0 top
GND  276.54,245.11 0 top
GND_BASE2  261.3,124.14 0 top
JP1  116.21,209.55 0 top
JP2  116.21,203.83 0 top
JP3  116.21,198.12 0 top
JP4  116.21,192.4 0 top
JP5  163.2,194.94 90 top
JP6  116.21,186.69 0 top
JP7  116.21,180.97 0 top
JP8  116.21,175.26 0 top
JP9  116.21,169.54 0 top
JP10  263.21,134.3 0 top
JP11  254.95,125.41 0 top
JP14  303.21,144.14 0 top
JP15  290.83,144.14 0 top
JP16  294,95.57 270 top
JP17  312.74,93.66 180 top
L1+  311.15,166.37 0 top
L1-  311.15,170.81 0 top
L2+  311.15,161.92 0 top
L2-  311.15,157.48 0 top
L3+  311.15,144.14 0 top
L3-  311.15,153.03 0 top
L4+  311.15,139.7 0 top
L4-  311.15,148.59 0 top
LED5  201.93,169.23 0 top
LED6  206.69,169.23 0 top
LED7  211.46,169.23 0 top
LED8  201.93,163.51 0 top
M1A  223.52,155.89 0 top
M1B  223.52,151.45 0 top
M1C  223.52,147 0 top
M2A  223.52,121.92 0 top
M2B  229.24,121.92 0 top
M2C  232.09,127.95 0 top
M3A  223.52,96.84 0 top
M3B  229.24,96.84 0 top
M3C  232.09,102.87 0 top
M4A  311.15,175.26 0 top
M4B  316.87,175.26 0 top
M4C  319.72,181.29 0 top
MC1  254.32,209.87 270 top
MCP1  127.95,96.52 0 top
MPU9150  186.69,192.09 0 top
PWM1  276.54,276.54 0 top
PWR  146.37,181.93 180 top
R1  139.38,205.74 180 top
R2  146.37,184.78 90 top
R3  251.78,108.9 0 top
R4  186.69,196.53 90 top
R5  184.15,196.53 90 top
R6  162.56,200.34 180 top
R7  146.37,177.8 90 top
R8  144.78,177.8 90 top
R9  142.56,205.74 0 top
R10  141.92,201.61 90 top
R11  205.74,159.38 0 top
R12  206.06,165.1 0 top
R13  210.82,165.1 0 top
R14  200.98,159.38 0 top
R15  251.78,104.14 0 top
R20  151.13,182.56 270 top
R21  149.54,182.56 90 top
R22  118.75,111.76 0 top
R23  123.51,111.76 0 top
R24  128.27,111.76 0 top
R25  187.64,186.69 0 top
R26  133.03,111.76 0 top
R27  137.8,111.76 0 top
R28  113.35,105.73 0 top
SJ2  252.41,112.39 0 top
SJ3  248.29,89.22 0 top
STATUS1  114.3,123.19 0 top
STATUS2  247.65,103.5 0 top
T5  119.38,126.68 0 top
T6  129.86,126.68 0 top
T7  114.3,117.79 0 top
T8  124.78,117.79 0 top
U2  141.92,178.43 0 top
U3  142.24,183.51 180 top
U$1  264.16,237.49 0 top
U$2  224.47,131.76 0 top
U$3  224.47,106.68 0 top
U$4  312.1,185.1 0 top
U$5  250.19,96.2 0 top
U$6  116.84,80.64 0 top
V+  276.54,248.6 0 top
V+_BASE  261.3,120.65 0 top
VBAT+  223.52,164.78 0 top
VBAT-  223.52,160.34 0 top
X1  146.37,171.45 90 top
X2  207.33,184.78 0 top
X3  206.06,101.92 0 top
X4  204.15,118.43 0 top
X5  204.15,110.17 0 top
X6  206.06,93.66 0 top

### Tracks (layer width: path | path; a pad name or v marks a point on that pad's centre or on a via)
+3V3  (15 unrouted)
  Top 0.254: 190.27,190.84 MPU9150.13 186.44,190.84 MPU9150.9 MPU9150.8 185.94,189.11 185.42,188.59 | MPU9150.3 183.55,192.34 C19.1 | 185.42,188.59 185.1,188.28 | 185.42,187.96 185.42,188.59 | 184.79,188.59 185.42,188.59
  Top 0.305: 190.27,190.84 C21.2
  Top 0.406: R25.1 186.69,186.69 185.42,187.96 185.1,188.28 184.79,188.59 183.83,189.55 183.83,191.13 183.52,191.45 183.1,191.45 C19.1
  Top 0.61: R4.2 R5.2 183.1,197.38 182.88,197.17 C19.1 C20.1 181.08,191.45
  pour Top (isolate 0.356): 70.02,245.59 105.88,245.59 105.88,281.46 70.02,281.46
AREF  (1 unrouted)
  Top 0.305: R10.2 140.4,202.46 D5.1
BATCNTRL  (2 unrouted)
BUSYLED1  (1 unrouted)
BUSYLED2  (1 unrouted)
BUSYLED3  (1 unrouted)
BUSYLED4  (1 unrouted)
BUZZER  (1 unrouted)
D+  (3 unrouted)
D-  (3 unrouted)
GND  (via drill 0.5, 0.7)  (58 unrouted)
  Top 0.254: C18.1 189.65,193.78 189.23,193.36 188.71,193.36 | v189.87,188.28 C17.1 187.44,189.33 MPU9150.11 | v184.15,194.31 184.15,193.67 184.49,193.34 MPU9150.1 MPU9150.18 MPU9150.17 188.08,192.84 187.96,192.72 187.96,192.09 188.21,191.84 MPU9150.15
  Top 0.305: U2.1 141,177.16 v139.7,177.16 | C18.1 C21.1 | 188.71,193.36 MPU9150.18
  Top 0.61: 146.25,181.29 PWR.C | 142.66,182.66 U3.3 | X1.GND 147.97,175.91 v148.59,176.53 150.31,176.53 | v182.88,188.28 C19.2 C20.2 180.56,189.23
  Top 0.813: C1.2 142.66,182.66 | 139.6,182.88 C3.2 139.57,182.85
  pour Bottom (isolate 0.406): 211.92,213.53 111.93,213.53 111.93,313.52 211.92,313.52
  pour Bottom (isolate 0.406): 105.88,245.59 70.02,245.59 70.02,281.46 105.88,281.46
INT1  (1 unrouted)
  Top 0.254: MPU9150.12 187.94,189.57 188.28,189.23 190.18,189.23 190.82,188.59 190.82,187.96 190.18,187.32 189.13,187.32 R25.2
LED1  (2 unrouted)
LED2  (2 unrouted)
LED3  (2 unrouted)
LED4  (2 unrouted)
N$1
  Top 0.254: MPU9150.20 187.44,194.74 187.96,195.26 190.29,195.26
  Top 0.305: 190.29,195.26 C18.2
N$2  (1 unrouted)
N$3  (1 unrouted)
N$4  (1 unrouted)
N$5
  Top 0.254: MPU9150.10 186.94,188.42
  Top 0.305: 186.94,188.42 C17.2
N$6  (2 unrouted)
  Top 0.61: 141.19,184.68 U3.2
N$9
  Top 0.61: PWR.A R2.1
N$10  (2 unrouted)
N$11  (2 unrouted)
N$12  (2 unrouted)
N$13  (2 unrouted)
N$14  (2 unrouted)
N$15  (2 unrouted)
N$16  (1 unrouted)
N$17  (1 unrouted)
N$18  (1 unrouted)
N$19  (1 unrouted)
N$20  (4 unrouted)
N$21  (1 unrouted)
N$22  (1 unrouted)
N$23  (1 unrouted)
N$24  (1 unrouted)
N$25  (1 unrouted)
N$26  (1 unrouted)
N$27  (1 unrouted)
N$28  (1 unrouted)
N$29  (1 unrouted)
N$30  (1 unrouted)
N$31  (1 unrouted)
N$32  (1 unrouted)
N$33  (1 unrouted)
N$34  (1 unrouted)
N$35  (1 unrouted)
N$36  (1 unrouted)
N$37  (1 unrouted)
N$38  (2 unrouted)
N$39  (1 unrouted)
PD0  (1 unrouted)
PD4  (1 unrouted)
PD5  (1 unrouted)
PDI_CLOCK  (2 unrouted)
PDI_DATA  (1 unrouted)
PWM1  (2 unrouted)
PWM2  (2 unrouted)
PWM3  (2 unrouted)
PWM4  (2 unrouted)
PWM5  (2 unrouted)
PWM6  (2 unrouted)
PWM7  (2 unrouted)
PWM8  (2 unrouted)
RXD0  (1 unrouted)
RXD2  (1 unrouted)
SCL  (1 unrouted)
  Top 0.254: MPU9150.23 185.94,194.93 R4.1 187.43,195.68 187.64,195.9 187.64,198.12 187.33,198.44 182.88,198.44 181.93,197.48 180.98,197.48 179.39,195.9
SDA  (via drill 0.5)  (1 unrouted)
  Top 0.254: R5.1 185.42,195.68 v185.42,195.58 185.42,194.09 MPU9150.24 | 179.39,193.67 v181.29,195.58
  Bottom 0.254: v185.42,195.58 v181.29,195.58
TXD0  (1 unrouted)
TXD2  (1 unrouted)
USB+
  Top 0.254: X1.D+ R7.1 145.52,177.8 144.15,177.8
  Top 0.305: 144.15,177.8 142.87,179.07 U2.3
USB-  (2 unrouted)
  Top 0.254: X1.D- 145.57,176.16
  Top 0.305: 144.71,177.02 144.56,177.16 142.88,177.16 142.88,177.48 142.87,177.48 U2.2
USBCNTRL  (1 unrouted)
  Top 0.305: R20.1 R21.2
V+  (via drill 0.7)  (4 unrouted)
  Top 0.305: R21.1 149.54,180.47
  Top 0.61: X1.VBUS 144.77,174.95 v143.83,175.89 139.38,175.89 138.75,176.53 138.75,178.43 139.38,179.07 140.51,179.07 U2.4 | v147.96,178.12 149.09,178.12
  Bottom 0.61: v143.83,175.89 145.73,175.89 v147.96,178.12
VCC  (31 unrouted)
  pour Top (isolate 0.356): 111.93,213.53 211.92,213.53 211.92,313.52 111.93,313.52
VDD  (11 unrouted)
XCK0  (1 unrouted)

### Text on the board
tPlace: Nano | QDC MK2.1 | M. Kesenheimer 2015 | VBAT | VUSB | USB B
bPlace: Nano QDC MK2.1 | M. Kesenheimer 2015